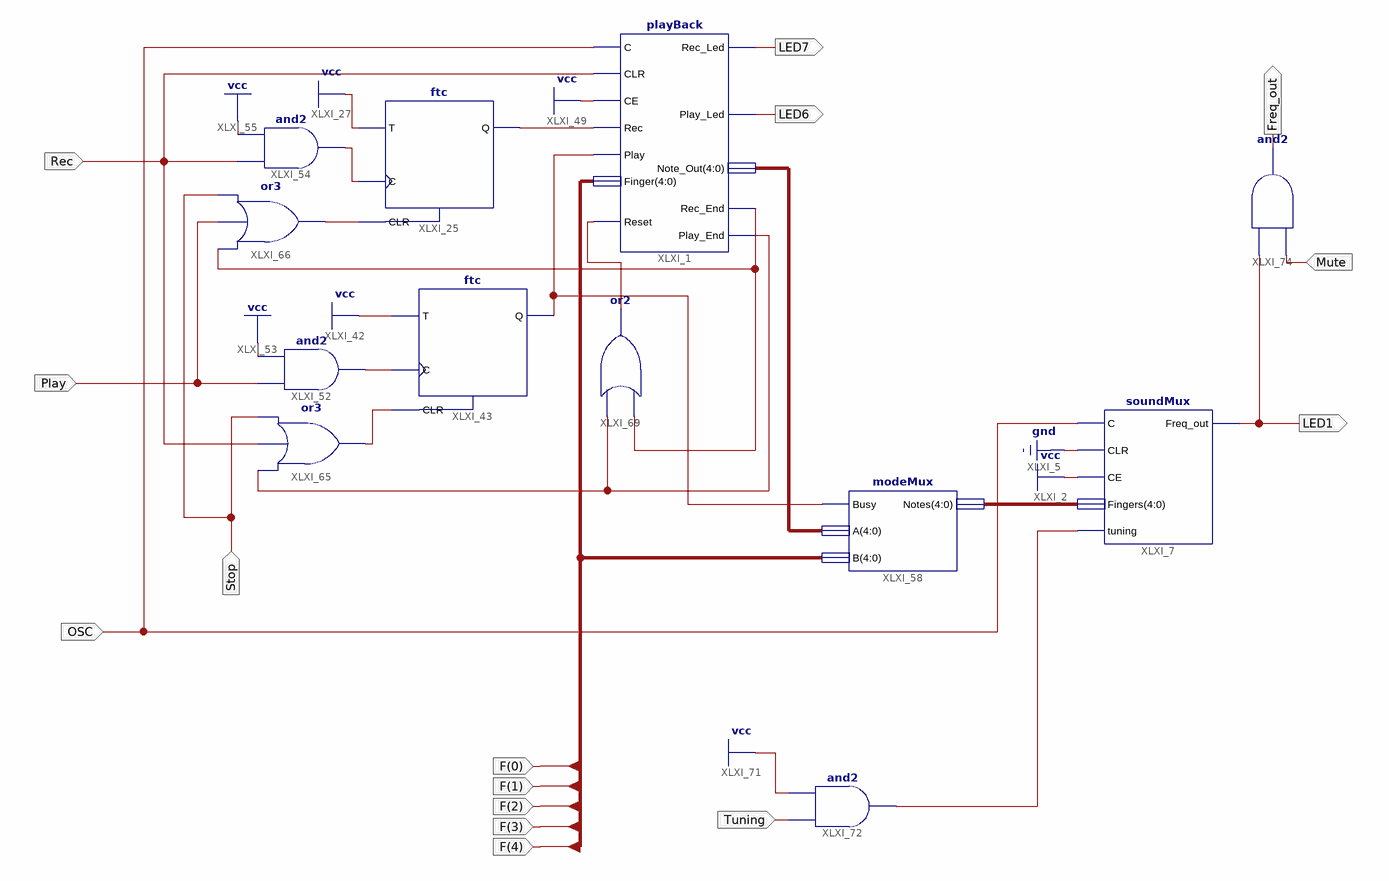
[diagram p0: schematic sheet 1]
// Xilinx ISE schematic trash.sch (spartan6) as structural Verilog: 12 symbols, 15 ports
module trash (
  input  [4:0] F,
  input  OSC,
  input  Play,
  input  Stop,
  input  Rec,
  input  Tuning,
  input  Mute,
  output LED6,
  output LED7,
  output LED1,
  output Freq_out
);

  wire XLXN_159, XLXN_163, XLXN_165, XLXN_221, XLXN_225, XLXN_226, XLXN_227, XLXN_228, XLXN_230, XLXN_246;
  wire [4:0] XLXN_176, XLXN_181;

  playBack XLXI_1 (
    .C(OSC), .CLR(Rec), .CE(1'b1), .Reset(XLXN_226), .Rec(XLXN_230), .Play(XLXN_225), .Finger(F),
    .Rec_Led(LED7), .Rec_End(XLXN_228), .Play_Led(LED6), .Play_End(XLXN_227), .Note_Out(XLXN_181));
  and XLXI_52 (XLXN_163, Play, 1'b1);
  ftc XLXI_25 (.C(XLXN_165), .CLR(XLXN_221), .T(1'b1), .Q(XLXN_230));
  and XLXI_54 (XLXN_165, Rec, 1'b1);
  ftc XLXI_43 (.C(XLXN_163), .CLR(XLXN_159), .T(1'b1), .Q(XLXN_225));
  soundMux XLXI_7 (.C(OSC), .CLR(1'b0), .CE(1'b1), .tuning(XLXN_246), .Fingers(XLXN_176), .Freq_out(LED1));
  modeMux XLXI_58 (.Busy(XLXN_225), .A(XLXN_181), .B(F), .Notes(XLXN_176));
  or XLXI_65 (XLXN_159, XLXN_227, Rec, Stop);
  or XLXI_69 (XLXN_226, XLXN_228, XLXN_227);
  or XLXI_66 (XLXN_221, XLXN_228, Play, Stop);
  and XLXI_72 (XLXN_246, Tuning, 1'b1);
  and XLXI_74 (Freq_out, Mute, LED1);
endmodule
